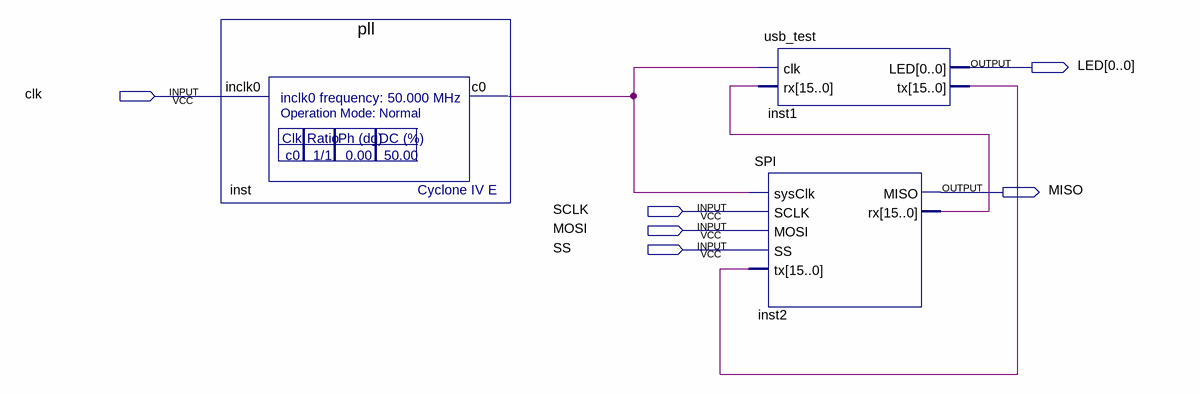
[diagram p0: schematic sheet]
// Quartus schematic Block1.bdf as structural Verilog: 3 symbols, 6 pins
module Block1 (
  input  clk,
  input  SCLK,
  input  MOSI,
  input  SS,
  output [0:0] LED,
  output MISO
);

  wire inst_c0;
  wire [15:0] inst1_tx, inst2_rx;

  pll inst (.inclk0(clk), .c0(inst_c0));
  usb_test inst1 (.clk(inst_c0), .rx(inst2_rx), .LED(LED[0]), .tx(inst1_tx));
  SPI inst2 (.sysClk(inst_c0), .SCLK(SCLK), .MOSI(MOSI), .SS(SS), .tx(inst1_tx), .MISO(MISO), .rx(inst2_rx));
endmodule
